# Altium schematic sheet 01_Cover_Page.SchDoc
size A3; SheetNumber: 1; SheetTotal: 5
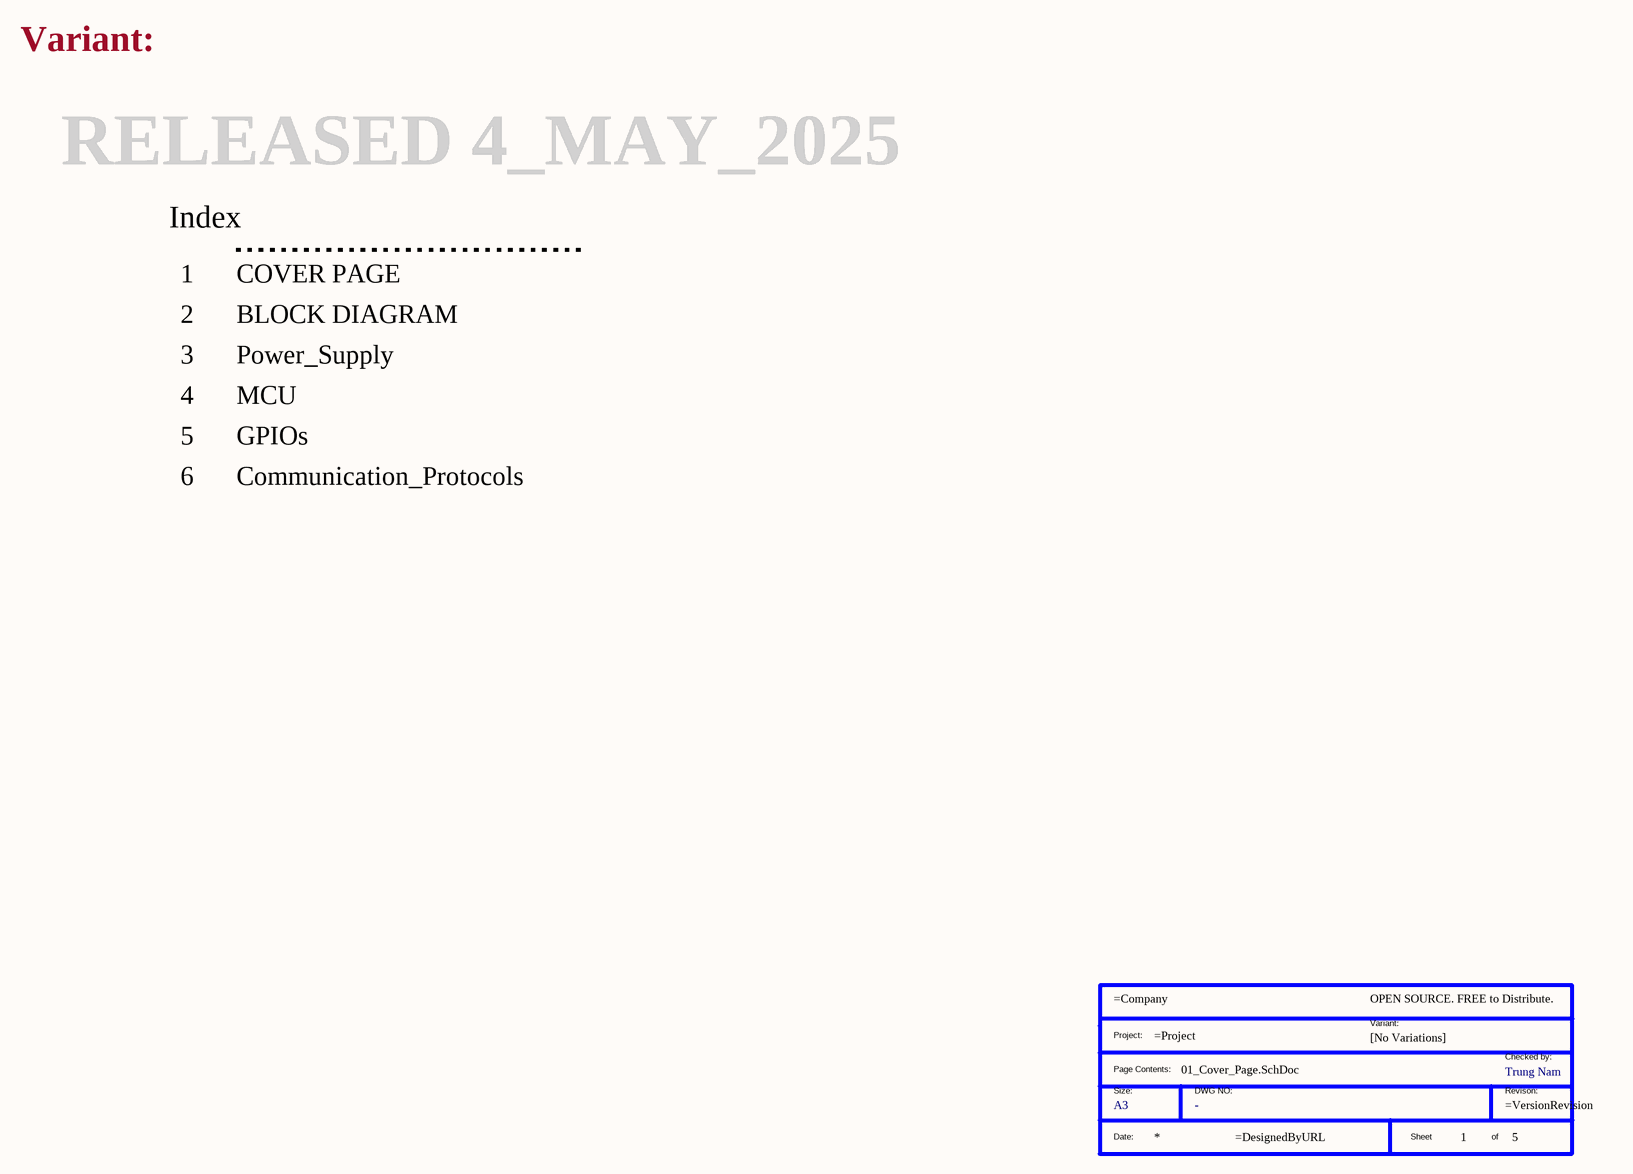
[diagram p0: 01_Cover_Page.SchDoc]

## Parts
*  Size: A3  Checked by: Trung Nam  (hidden comment: TitleBlock)  (graphical)

## Notes on the sheet
- Variant:
- RELEASED 4_MAY_2025
- Index
- 1
- 2
- COVER PAGE
- BLOCK DIAGRAM
- 3
- Power_Supply
- 4
- 5
- MCU
- GPIOs
- 6
- Communication_Protocols
- (in symbol TitleBlock) OPEN SOURCE. FREE to Distribute.; Project:; Variant:; [No Variations]; Checked by:; Page Contents:; Size:; DWG NO:; Revison:; Date:; Sheet; of

## Library data of the parts
* = TitleBlock: Standard Title Block; DWG NO: -